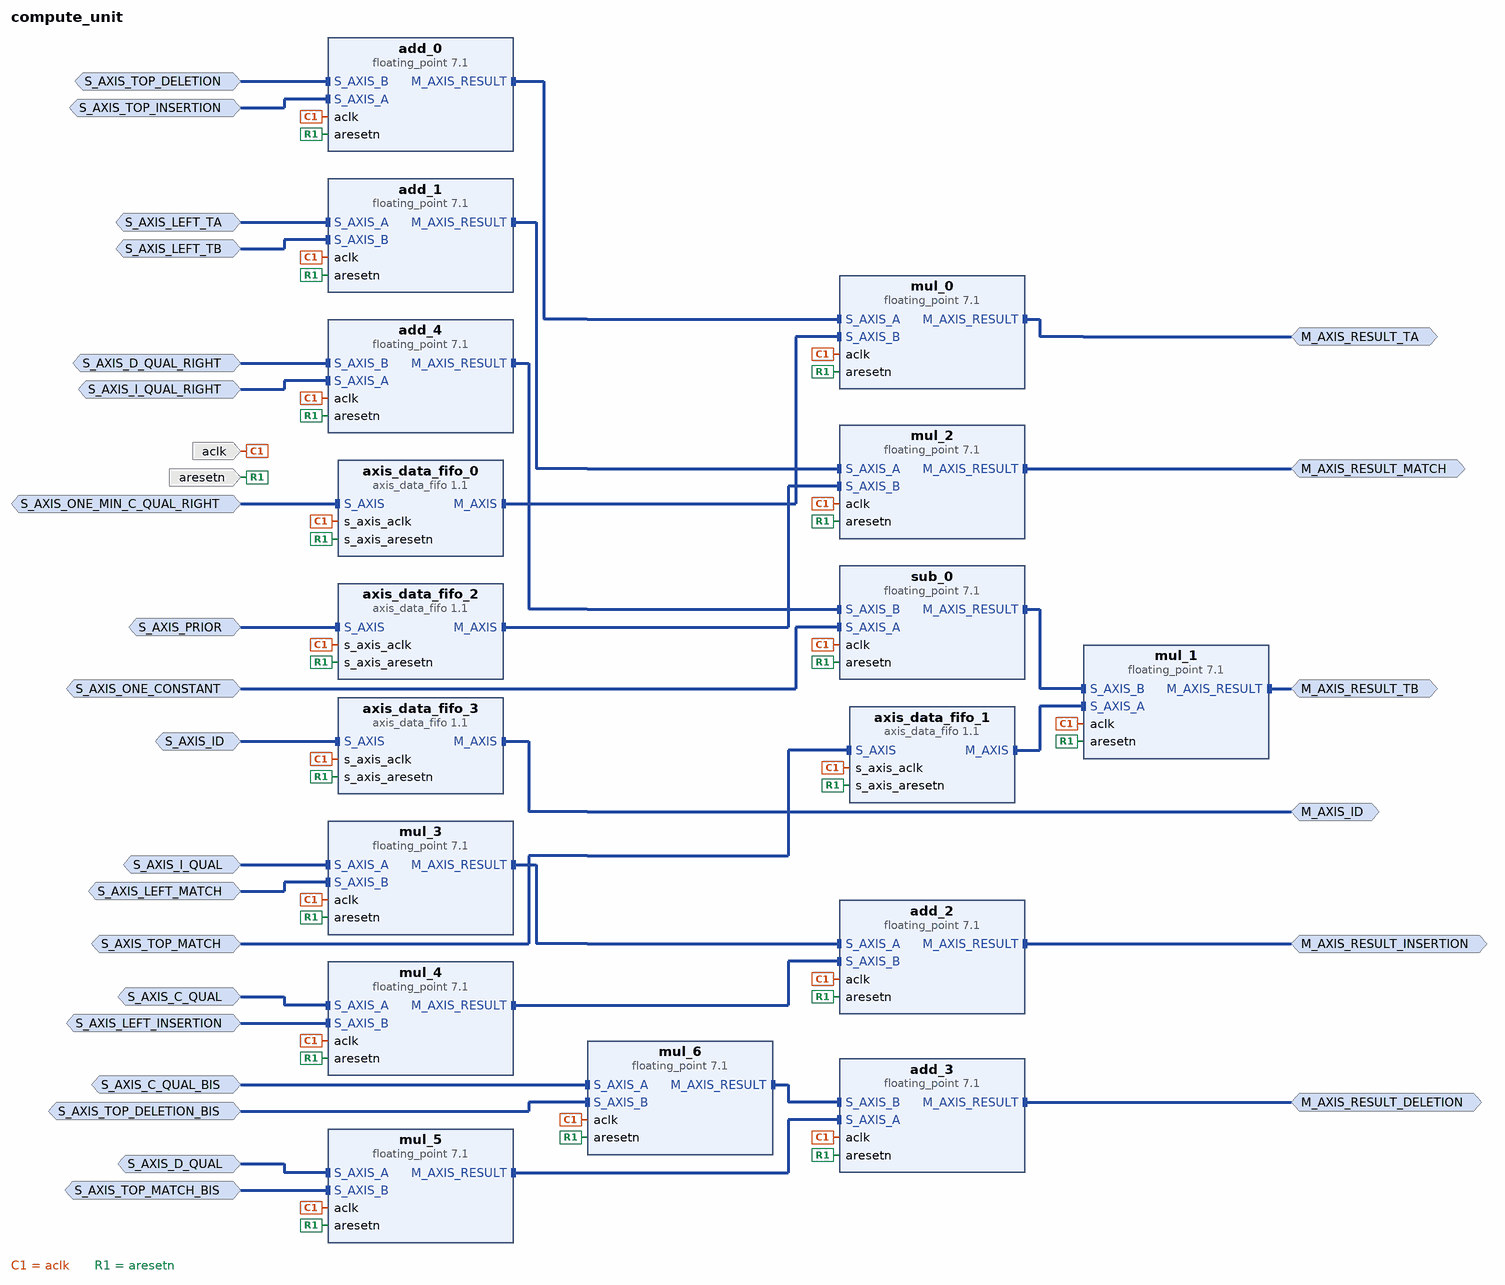
[diagram p0: block diagram of the top level]
# Vivado block design compute_unit, xcvu9p-flgb2104-2-i, Vivado 2017.4
create_bd_design compute_unit

create_bd_intf_port -mode Master -vlnv xilinx.com:interface:axis_rtl:1.0 M_AXIS_ID
set_property -dict {CONFIG.FREQ_HZ 10000000} [get_bd_intf_ports M_AXIS_ID]
create_bd_intf_port -mode Master -vlnv xilinx.com:interface:axis_rtl:1.0 M_AXIS_RESULT_DELETION
set_property -dict {CONFIG.FREQ_HZ 10000000} [get_bd_intf_ports M_AXIS_RESULT_DELETION]
create_bd_intf_port -mode Master -vlnv xilinx.com:interface:axis_rtl:1.0 M_AXIS_RESULT_INSERTION
set_property -dict {CONFIG.FREQ_HZ 10000000} [get_bd_intf_ports M_AXIS_RESULT_INSERTION]
create_bd_intf_port -mode Master -vlnv xilinx.com:interface:axis_rtl:1.0 M_AXIS_RESULT_MATCH
set_property -dict {CONFIG.FREQ_HZ 10000000} [get_bd_intf_ports M_AXIS_RESULT_MATCH]
create_bd_intf_port -mode Master -vlnv xilinx.com:interface:axis_rtl:1.0 M_AXIS_RESULT_TA
set_property -dict {CONFIG.FREQ_HZ 10000000} [get_bd_intf_ports M_AXIS_RESULT_TA]
create_bd_intf_port -mode Master -vlnv xilinx.com:interface:axis_rtl:1.0 M_AXIS_RESULT_TB
set_property -dict {CONFIG.FREQ_HZ 10000000} [get_bd_intf_ports M_AXIS_RESULT_TB]
create_bd_intf_port -mode Slave -vlnv xilinx.com:interface:axis_rtl:1.0 S_AXIS_C_QUAL
set_property -dict [list \
  CONFIG.TDATA_NUM_BYTES 4 \
  CONFIG.TDEST_WIDTH 0 \
  CONFIG.TID_WIDTH 0 \
  CONFIG.TUSER_WIDTH 0 \
  CONFIG.HAS_TREADY 1 \
  CONFIG.HAS_TSTRB 0 \
  CONFIG.HAS_TKEEP 0 \
  CONFIG.HAS_TLAST 0 \
  CONFIG.FREQ_HZ 10000000 \
  CONFIG.LAYERED_METADATA undef \
] [get_bd_intf_ports S_AXIS_C_QUAL]
create_bd_intf_port -mode Slave -vlnv xilinx.com:interface:axis_rtl:1.0 S_AXIS_C_QUAL_BIS
set_property -dict [list \
  CONFIG.TDATA_NUM_BYTES 4 \
  CONFIG.TDEST_WIDTH 0 \
  CONFIG.TID_WIDTH 0 \
  CONFIG.TUSER_WIDTH 0 \
  CONFIG.HAS_TREADY 1 \
  CONFIG.HAS_TSTRB 0 \
  CONFIG.HAS_TKEEP 0 \
  CONFIG.HAS_TLAST 0 \
  CONFIG.FREQ_HZ 10000000 \
  CONFIG.LAYERED_METADATA undef \
] [get_bd_intf_ports S_AXIS_C_QUAL_BIS]
create_bd_intf_port -mode Slave -vlnv xilinx.com:interface:axis_rtl:1.0 S_AXIS_D_QUAL
set_property -dict [list \
  CONFIG.TDATA_NUM_BYTES 4 \
  CONFIG.TDEST_WIDTH 0 \
  CONFIG.TID_WIDTH 0 \
  CONFIG.TUSER_WIDTH 0 \
  CONFIG.HAS_TREADY 1 \
  CONFIG.HAS_TSTRB 0 \
  CONFIG.HAS_TKEEP 0 \
  CONFIG.HAS_TLAST 0 \
  CONFIG.FREQ_HZ 10000000 \
  CONFIG.LAYERED_METADATA undef \
] [get_bd_intf_ports S_AXIS_D_QUAL]
create_bd_intf_port -mode Slave -vlnv xilinx.com:interface:axis_rtl:1.0 S_AXIS_D_QUAL_RIGHT
set_property -dict [list \
  CONFIG.TDATA_NUM_BYTES 4 \
  CONFIG.TDEST_WIDTH 0 \
  CONFIG.TID_WIDTH 0 \
  CONFIG.TUSER_WIDTH 0 \
  CONFIG.HAS_TREADY 1 \
  CONFIG.HAS_TSTRB 0 \
  CONFIG.HAS_TKEEP 0 \
  CONFIG.HAS_TLAST 0 \
  CONFIG.FREQ_HZ 10000000 \
  CONFIG.LAYERED_METADATA undef \
] [get_bd_intf_ports S_AXIS_D_QUAL_RIGHT]
create_bd_intf_port -mode Slave -vlnv xilinx.com:interface:axis_rtl:1.0 S_AXIS_ID
set_property -dict [list \
  CONFIG.TDATA_NUM_BYTES 4 \
  CONFIG.TDEST_WIDTH 0 \
  CONFIG.TID_WIDTH 0 \
  CONFIG.TUSER_WIDTH 0 \
  CONFIG.HAS_TREADY 1 \
  CONFIG.HAS_TSTRB 0 \
  CONFIG.HAS_TKEEP 0 \
  CONFIG.HAS_TLAST 0 \
  CONFIG.FREQ_HZ 10000000 \
  CONFIG.LAYERED_METADATA undef \
] [get_bd_intf_ports S_AXIS_ID]
create_bd_intf_port -mode Slave -vlnv xilinx.com:interface:axis_rtl:1.0 S_AXIS_I_QUAL
set_property -dict [list \
  CONFIG.TDATA_NUM_BYTES 4 \
  CONFIG.TDEST_WIDTH 0 \
  CONFIG.TID_WIDTH 0 \
  CONFIG.TUSER_WIDTH 0 \
  CONFIG.HAS_TREADY 1 \
  CONFIG.HAS_TSTRB 0 \
  CONFIG.HAS_TKEEP 0 \
  CONFIG.HAS_TLAST 0 \
  CONFIG.FREQ_HZ 10000000 \
  CONFIG.LAYERED_METADATA undef \
] [get_bd_intf_ports S_AXIS_I_QUAL]
create_bd_intf_port -mode Slave -vlnv xilinx.com:interface:axis_rtl:1.0 S_AXIS_I_QUAL_RIGHT
set_property -dict [list \
  CONFIG.TDATA_NUM_BYTES 4 \
  CONFIG.TDEST_WIDTH 0 \
  CONFIG.TID_WIDTH 0 \
  CONFIG.TUSER_WIDTH 0 \
  CONFIG.HAS_TREADY 1 \
  CONFIG.HAS_TSTRB 0 \
  CONFIG.HAS_TKEEP 0 \
  CONFIG.HAS_TLAST 0 \
  CONFIG.FREQ_HZ 10000000 \
  CONFIG.LAYERED_METADATA undef \
] [get_bd_intf_ports S_AXIS_I_QUAL_RIGHT]
create_bd_intf_port -mode Slave -vlnv xilinx.com:interface:axis_rtl:1.0 S_AXIS_LEFT_INSERTION
set_property -dict [list \
  CONFIG.TDATA_NUM_BYTES 4 \
  CONFIG.TDEST_WIDTH 0 \
  CONFIG.TID_WIDTH 0 \
  CONFIG.TUSER_WIDTH 0 \
  CONFIG.HAS_TREADY 1 \
  CONFIG.HAS_TSTRB 0 \
  CONFIG.HAS_TKEEP 0 \
  CONFIG.HAS_TLAST 0 \
  CONFIG.FREQ_HZ 10000000 \
  CONFIG.LAYERED_METADATA undef \
] [get_bd_intf_ports S_AXIS_LEFT_INSERTION]
create_bd_intf_port -mode Slave -vlnv xilinx.com:interface:axis_rtl:1.0 S_AXIS_LEFT_MATCH
set_property -dict [list \
  CONFIG.TDATA_NUM_BYTES 4 \
  CONFIG.TDEST_WIDTH 0 \
  CONFIG.TID_WIDTH 0 \
  CONFIG.TUSER_WIDTH 0 \
  CONFIG.HAS_TREADY 1 \
  CONFIG.HAS_TSTRB 0 \
  CONFIG.HAS_TKEEP 0 \
  CONFIG.HAS_TLAST 0 \
  CONFIG.FREQ_HZ 10000000 \
  CONFIG.LAYERED_METADATA undef \
] [get_bd_intf_ports S_AXIS_LEFT_MATCH]
create_bd_intf_port -mode Slave -vlnv xilinx.com:interface:axis_rtl:1.0 S_AXIS_LEFT_TA
set_property -dict [list \
  CONFIG.TDATA_NUM_BYTES 4 \
  CONFIG.TDEST_WIDTH 0 \
  CONFIG.TID_WIDTH 0 \
  CONFIG.TUSER_WIDTH 0 \
  CONFIG.HAS_TREADY 1 \
  CONFIG.HAS_TSTRB 0 \
  CONFIG.HAS_TKEEP 0 \
  CONFIG.HAS_TLAST 0 \
  CONFIG.FREQ_HZ 10000000 \
  CONFIG.LAYERED_METADATA undef \
] [get_bd_intf_ports S_AXIS_LEFT_TA]
create_bd_intf_port -mode Slave -vlnv xilinx.com:interface:axis_rtl:1.0 S_AXIS_LEFT_TB
set_property -dict [list \
  CONFIG.TDATA_NUM_BYTES 4 \
  CONFIG.TDEST_WIDTH 0 \
  CONFIG.TID_WIDTH 0 \
  CONFIG.TUSER_WIDTH 0 \
  CONFIG.HAS_TREADY 1 \
  CONFIG.HAS_TSTRB 0 \
  CONFIG.HAS_TKEEP 0 \
  CONFIG.HAS_TLAST 0 \
  CONFIG.FREQ_HZ 10000000 \
  CONFIG.LAYERED_METADATA undef \
] [get_bd_intf_ports S_AXIS_LEFT_TB]
create_bd_intf_port -mode Slave -vlnv xilinx.com:interface:axis_rtl:1.0 S_AXIS_ONE_CONSTANT
set_property -dict [list \
  CONFIG.TDATA_NUM_BYTES 4 \
  CONFIG.TDEST_WIDTH 0 \
  CONFIG.TID_WIDTH 0 \
  CONFIG.TUSER_WIDTH 0 \
  CONFIG.HAS_TREADY 1 \
  CONFIG.HAS_TSTRB 0 \
  CONFIG.HAS_TKEEP 0 \
  CONFIG.HAS_TLAST 0 \
  CONFIG.FREQ_HZ 10000000 \
  CONFIG.LAYERED_METADATA undef \
] [get_bd_intf_ports S_AXIS_ONE_CONSTANT]
create_bd_intf_port -mode Slave -vlnv xilinx.com:interface:axis_rtl:1.0 S_AXIS_ONE_MIN_C_QUAL_RIGHT
set_property -dict [list \
  CONFIG.TDATA_NUM_BYTES 4 \
  CONFIG.TDEST_WIDTH 0 \
  CONFIG.TID_WIDTH 0 \
  CONFIG.TUSER_WIDTH 0 \
  CONFIG.HAS_TREADY 1 \
  CONFIG.HAS_TSTRB 0 \
  CONFIG.HAS_TKEEP 0 \
  CONFIG.HAS_TLAST 0 \
  CONFIG.FREQ_HZ 10000000 \
  CONFIG.LAYERED_METADATA undef \
] [get_bd_intf_ports S_AXIS_ONE_MIN_C_QUAL_RIGHT]
create_bd_intf_port -mode Slave -vlnv xilinx.com:interface:axis_rtl:1.0 S_AXIS_PRIOR
set_property -dict [list \
  CONFIG.TDATA_NUM_BYTES 4 \
  CONFIG.TDEST_WIDTH 0 \
  CONFIG.TID_WIDTH 0 \
  CONFIG.TUSER_WIDTH 0 \
  CONFIG.HAS_TREADY 1 \
  CONFIG.HAS_TSTRB 0 \
  CONFIG.HAS_TKEEP 0 \
  CONFIG.HAS_TLAST 0 \
  CONFIG.FREQ_HZ 10000000 \
  CONFIG.LAYERED_METADATA undef \
] [get_bd_intf_ports S_AXIS_PRIOR]
create_bd_intf_port -mode Slave -vlnv xilinx.com:interface:axis_rtl:1.0 S_AXIS_TOP_DELETION
set_property -dict [list \
  CONFIG.TDATA_NUM_BYTES 4 \
  CONFIG.TDEST_WIDTH 0 \
  CONFIG.TID_WIDTH 0 \
  CONFIG.TUSER_WIDTH 0 \
  CONFIG.HAS_TREADY 1 \
  CONFIG.HAS_TSTRB 0 \
  CONFIG.HAS_TKEEP 0 \
  CONFIG.HAS_TLAST 0 \
  CONFIG.FREQ_HZ 10000000 \
  CONFIG.LAYERED_METADATA undef \
] [get_bd_intf_ports S_AXIS_TOP_DELETION]
create_bd_intf_port -mode Slave -vlnv xilinx.com:interface:axis_rtl:1.0 S_AXIS_TOP_DELETION_BIS
set_property -dict [list \
  CONFIG.TDATA_NUM_BYTES 4 \
  CONFIG.TDEST_WIDTH 0 \
  CONFIG.TID_WIDTH 0 \
  CONFIG.TUSER_WIDTH 0 \
  CONFIG.HAS_TREADY 1 \
  CONFIG.HAS_TSTRB 0 \
  CONFIG.HAS_TKEEP 0 \
  CONFIG.HAS_TLAST 0 \
  CONFIG.FREQ_HZ 10000000 \
  CONFIG.LAYERED_METADATA undef \
] [get_bd_intf_ports S_AXIS_TOP_DELETION_BIS]
create_bd_intf_port -mode Slave -vlnv xilinx.com:interface:axis_rtl:1.0 S_AXIS_TOP_INSERTION
set_property -dict [list \
  CONFIG.TDATA_NUM_BYTES 4 \
  CONFIG.TDEST_WIDTH 0 \
  CONFIG.TID_WIDTH 0 \
  CONFIG.TUSER_WIDTH 0 \
  CONFIG.HAS_TREADY 1 \
  CONFIG.HAS_TSTRB 0 \
  CONFIG.HAS_TKEEP 0 \
  CONFIG.HAS_TLAST 0 \
  CONFIG.FREQ_HZ 10000000 \
  CONFIG.LAYERED_METADATA undef \
] [get_bd_intf_ports S_AXIS_TOP_INSERTION]
create_bd_intf_port -mode Slave -vlnv xilinx.com:interface:axis_rtl:1.0 S_AXIS_TOP_MATCH
set_property -dict [list \
  CONFIG.TDATA_NUM_BYTES 4 \
  CONFIG.TDEST_WIDTH 0 \
  CONFIG.TID_WIDTH 0 \
  CONFIG.TUSER_WIDTH 0 \
  CONFIG.HAS_TREADY 1 \
  CONFIG.HAS_TSTRB 0 \
  CONFIG.HAS_TKEEP 0 \
  CONFIG.HAS_TLAST 0 \
  CONFIG.FREQ_HZ 10000000 \
  CONFIG.LAYERED_METADATA undef \
] [get_bd_intf_ports S_AXIS_TOP_MATCH]
create_bd_intf_port -mode Slave -vlnv xilinx.com:interface:axis_rtl:1.0 S_AXIS_TOP_MATCH_BIS
set_property -dict [list \
  CONFIG.TDATA_NUM_BYTES 4 \
  CONFIG.TDEST_WIDTH 0 \
  CONFIG.TID_WIDTH 0 \
  CONFIG.TUSER_WIDTH 0 \
  CONFIG.HAS_TREADY 1 \
  CONFIG.HAS_TSTRB 0 \
  CONFIG.HAS_TKEEP 0 \
  CONFIG.HAS_TLAST 0 \
  CONFIG.FREQ_HZ 10000000 \
  CONFIG.LAYERED_METADATA undef \
] [get_bd_intf_ports S_AXIS_TOP_MATCH_BIS]
create_bd_port -dir I -type clk aclk
set_property -dict [list \
  CONFIG.FREQ_HZ 10000000 \
  CONFIG.ASSOCIATED_BUSIF S_AXIS_fI_j:S_AXIS_fD_j:S_AXIS_a_dm:S_AXIS_a_mm:S_AXIS_fM_j:S_AXIS_ta_i:S_AXIS_tb_i:S_AXIS_prior:S_AXIS_a_mi:S_AXIS_fM_i:S_AXIS_a_ii:S_AXIS_fI_i:S_AXIS_a_md:S_AXIS_fM_j_copy:S_AXIS_a_dd:S_AXIS_fD_j_copy:M_AXIS_RESULT_TBA:M_AXIS_RESULT_TB:M_AXIS_RESULT_MATCH:M_AXIS_RESULT_INSERTION:M_AXIS_RESULT_DELETION:M_AXIS_RESULT_TA:S_AXIS_TOP_INSERTION:S_AXIS_TOP_DELETION:S_AXIS_ONE_MIN_C_QUAL_RIGHT:S_AXIS_TOP_MATCH:S_AXIS_ONE_MIN_I_QUAL_RIGHT:S_AXIS_D_QUAL_RIGHT:S_AXIS_LEFT_TA:S_AXIS_LEFT_TB:S_AXIS_I_QUAL:S_AXIS_LEFT_MATCH:S_AXIS_C_QUAL:S_AXIS_LEFT_INSERTION:S_AXIS_D_QUAL:S_AXIS_TOP_MATCH_BIS:S_AXIS_C_QUAL_BIS:S_AXIS_TOP_DELETION_BIS:M_AXIS_ID:S_AXIS_ID:S_AXIS_ONE_CONSTANT:S_AXIS_I_QUAL_RIGHT \
] [get_bd_ports aclk]
create_bd_port -dir I -type rst aresetn

create_bd_cell -type ip -vlnv xilinx.com:ip:floating_point:7.1 add_0
set_property -dict [list \
  CONFIG.Add_Sub_Value Add \
  CONFIG.Flow_Control Blocking \
  CONFIG.Has_RESULT_TREADY true \
  CONFIG.C_Latency 12 \
  CONFIG.Has_ARESETn true \
] [get_bd_cells add_0]
create_bd_cell -type ip -vlnv xilinx.com:ip:floating_point:7.1 add_1
set_property -dict [list \
  CONFIG.Add_Sub_Value Add \
  CONFIG.Flow_Control Blocking \
  CONFIG.Has_RESULT_TREADY true \
  CONFIG.C_Latency 12 \
  CONFIG.Has_ARESETn true \
] [get_bd_cells add_1]
create_bd_cell -type ip -vlnv xilinx.com:ip:floating_point:7.1 add_2
set_property -dict [list \
  CONFIG.Add_Sub_Value Add \
  CONFIG.Flow_Control Blocking \
  CONFIG.Has_RESULT_TREADY true \
  CONFIG.C_Latency 12 \
  CONFIG.Has_ARESETn true \
] [get_bd_cells add_2]
create_bd_cell -type ip -vlnv xilinx.com:ip:floating_point:7.1 add_3
set_property -dict [list \
  CONFIG.Add_Sub_Value Add \
  CONFIG.Flow_Control Blocking \
  CONFIG.Has_RESULT_TREADY true \
  CONFIG.C_Latency 12 \
  CONFIG.Has_ARESETn true \
] [get_bd_cells add_3]
create_bd_cell -type ip -vlnv xilinx.com:ip:floating_point:7.1 add_4
set_property -dict [list \
  CONFIG.Operation_Type Add_Subtract \
  CONFIG.Add_Sub_Value Add \
  CONFIG.Result_Precision_Type Single \
  CONFIG.C_Result_Exponent_Width 8 \
  CONFIG.C_Result_Fraction_Width 24 \
  CONFIG.C_Mult_Usage Full_Usage \
  CONFIG.Maximum_Latency false \
  CONFIG.C_Latency 6 \
  CONFIG.C_Rate 1 \
  CONFIG.Has_ARESETn true \
  CONFIG.Has_A_TLAST false \
  CONFIG.RESULT_TLAST_Behv Null \
] [get_bd_cells add_4]
create_bd_cell -type ip -vlnv xilinx.com:ip:axis_data_fifo:1.1 axis_data_fifo_0
set_property -dict {CONFIG.TDATA_NUM_BYTES 4 CONFIG.FIFO_DEPTH 16} [get_bd_cells axis_data_fifo_0]
create_bd_cell -type ip -vlnv xilinx.com:ip:axis_data_fifo:1.1 axis_data_fifo_1
set_property -dict {CONFIG.TDATA_NUM_BYTES 4 CONFIG.FIFO_DEPTH 16} [get_bd_cells axis_data_fifo_1]
create_bd_cell -type ip -vlnv xilinx.com:ip:axis_data_fifo:1.1 axis_data_fifo_2
set_property -dict {CONFIG.TDATA_NUM_BYTES 4 CONFIG.FIFO_DEPTH 16} [get_bd_cells axis_data_fifo_2]
create_bd_cell -type ip -vlnv xilinx.com:ip:axis_data_fifo:1.1 axis_data_fifo_3
set_property -dict {CONFIG.TDATA_NUM_BYTES 4 CONFIG.FIFO_DEPTH 32} [get_bd_cells axis_data_fifo_3]
create_bd_cell -type ip -vlnv xilinx.com:ip:floating_point:7.1 mul_0
set_property -dict [list \
  CONFIG.Operation_Type Multiply \
  CONFIG.Result_Precision_Type Single \
  CONFIG.C_Result_Exponent_Width 8 \
  CONFIG.C_Result_Fraction_Width 24 \
  CONFIG.C_Mult_Usage Full_Usage \
  CONFIG.Flow_Control Blocking \
  CONFIG.Has_RESULT_TREADY true \
  CONFIG.C_Latency 9 \
  CONFIG.C_Rate 1 \
  CONFIG.Has_ARESETn true \
] [get_bd_cells mul_0]
create_bd_cell -type ip -vlnv xilinx.com:ip:floating_point:7.1 mul_1
set_property -dict [list \
  CONFIG.Operation_Type Multiply \
  CONFIG.Result_Precision_Type Single \
  CONFIG.C_Result_Exponent_Width 8 \
  CONFIG.C_Result_Fraction_Width 24 \
  CONFIG.C_Mult_Usage Full_Usage \
  CONFIG.Flow_Control Blocking \
  CONFIG.Has_RESULT_TREADY true \
  CONFIG.C_Latency 9 \
  CONFIG.C_Rate 1 \
  CONFIG.Has_ARESETn true \
] [get_bd_cells mul_1]
create_bd_cell -type ip -vlnv xilinx.com:ip:floating_point:7.1 mul_2
set_property -dict [list \
  CONFIG.Operation_Type Multiply \
  CONFIG.Result_Precision_Type Single \
  CONFIG.C_Result_Exponent_Width 8 \
  CONFIG.C_Result_Fraction_Width 24 \
  CONFIG.C_Mult_Usage Full_Usage \
  CONFIG.Flow_Control Blocking \
  CONFIG.Has_RESULT_TREADY true \
  CONFIG.C_Latency 9 \
  CONFIG.C_Rate 1 \
  CONFIG.Has_ARESETn true \
] [get_bd_cells mul_2]
create_bd_cell -type ip -vlnv xilinx.com:ip:floating_point:7.1 mul_3
set_property -dict [list \
  CONFIG.Operation_Type Multiply \
  CONFIG.Result_Precision_Type Single \
  CONFIG.C_Result_Exponent_Width 8 \
  CONFIG.C_Result_Fraction_Width 24 \
  CONFIG.C_Mult_Usage Full_Usage \
  CONFIG.Flow_Control Blocking \
  CONFIG.Has_RESULT_TREADY true \
  CONFIG.C_Latency 9 \
  CONFIG.C_Rate 1 \
  CONFIG.Has_ARESETn true \
] [get_bd_cells mul_3]
create_bd_cell -type ip -vlnv xilinx.com:ip:floating_point:7.1 mul_4
set_property -dict [list \
  CONFIG.Operation_Type Multiply \
  CONFIG.Result_Precision_Type Single \
  CONFIG.C_Result_Exponent_Width 8 \
  CONFIG.C_Result_Fraction_Width 24 \
  CONFIG.C_Mult_Usage Full_Usage \
  CONFIG.Flow_Control Blocking \
  CONFIG.Has_RESULT_TREADY true \
  CONFIG.C_Latency 9 \
  CONFIG.C_Rate 1 \
  CONFIG.Has_ARESETn true \
] [get_bd_cells mul_4]
create_bd_cell -type ip -vlnv xilinx.com:ip:floating_point:7.1 mul_5
set_property -dict [list \
  CONFIG.Operation_Type Multiply \
  CONFIG.Result_Precision_Type Single \
  CONFIG.C_Result_Exponent_Width 8 \
  CONFIG.C_Result_Fraction_Width 24 \
  CONFIG.C_Mult_Usage Full_Usage \
  CONFIG.Flow_Control Blocking \
  CONFIG.Has_RESULT_TREADY true \
  CONFIG.C_Latency 9 \
  CONFIG.C_Rate 1 \
  CONFIG.Has_ARESETn true \
] [get_bd_cells mul_5]
create_bd_cell -type ip -vlnv xilinx.com:ip:floating_point:7.1 mul_6
set_property -dict [list \
  CONFIG.Operation_Type Multiply \
  CONFIG.Result_Precision_Type Single \
  CONFIG.C_Result_Exponent_Width 8 \
  CONFIG.C_Result_Fraction_Width 24 \
  CONFIG.C_Mult_Usage Full_Usage \
  CONFIG.Flow_Control Blocking \
  CONFIG.Has_RESULT_TREADY true \
  CONFIG.C_Latency 9 \
  CONFIG.C_Rate 1 \
  CONFIG.Has_ARESETn true \
] [get_bd_cells mul_6]
create_bd_cell -type ip -vlnv xilinx.com:ip:floating_point:7.1 sub_0
set_property -dict [list \
  CONFIG.Add_Sub_Value Subtract \
  CONFIG.Maximum_Latency false \
  CONFIG.C_Latency 6 \
  CONFIG.Has_ACLKEN false \
  CONFIG.Has_ARESETn true \
] [get_bd_cells sub_0]

# ---- connections ----

connect_bd_intf_net [get_bd_intf_pins add_0/M_AXIS_RESULT] [get_bd_intf_pins mul_0/S_AXIS_A]
connect_bd_intf_net [get_bd_intf_pins add_1/M_AXIS_RESULT] [get_bd_intf_pins mul_2/S_AXIS_A]
connect_bd_intf_net [get_bd_intf_pins add_4/M_AXIS_RESULT] [get_bd_intf_pins sub_0/S_AXIS_B]
connect_bd_intf_net [get_bd_intf_pins axis_data_fifo_0/M_AXIS] [get_bd_intf_pins mul_0/S_AXIS_B]
connect_bd_intf_net [get_bd_intf_pins axis_data_fifo_1/M_AXIS] [get_bd_intf_pins mul_1/S_AXIS_A]
connect_bd_intf_net -intf_net axis_data_fifo_3_M_AXIS [get_bd_intf_pins axis_data_fifo_2/M_AXIS] [get_bd_intf_pins mul_2/S_AXIS_B]
connect_bd_intf_net -intf_net floating_point_0_M_AXIS_RESULT [get_bd_intf_pins mul_1/S_AXIS_B] [get_bd_intf_pins sub_0/M_AXIS_RESULT]
connect_bd_intf_net [get_bd_intf_pins add_2/S_AXIS_A] [get_bd_intf_pins mul_3/M_AXIS_RESULT]
connect_bd_intf_net [get_bd_intf_pins add_2/S_AXIS_B] [get_bd_intf_pins mul_4/M_AXIS_RESULT]
connect_bd_intf_net [get_bd_intf_pins add_3/S_AXIS_A] [get_bd_intf_pins mul_5/M_AXIS_RESULT]
connect_bd_intf_net [get_bd_intf_pins add_3/S_AXIS_B] [get_bd_intf_pins mul_6/M_AXIS_RESULT]
connect_bd_intf_net [get_bd_intf_ports M_AXIS_ID] [get_bd_intf_pins axis_data_fifo_3/M_AXIS]
connect_bd_intf_net [get_bd_intf_ports M_AXIS_RESULT_DELETION] [get_bd_intf_pins add_3/M_AXIS_RESULT]
connect_bd_intf_net [get_bd_intf_ports M_AXIS_RESULT_INSERTION] [get_bd_intf_pins add_2/M_AXIS_RESULT]
connect_bd_intf_net [get_bd_intf_ports M_AXIS_RESULT_MATCH] [get_bd_intf_pins mul_2/M_AXIS_RESULT]
connect_bd_intf_net [get_bd_intf_ports M_AXIS_RESULT_TA] [get_bd_intf_pins mul_0/M_AXIS_RESULT]
connect_bd_intf_net [get_bd_intf_ports M_AXIS_RESULT_TB] [get_bd_intf_pins mul_1/M_AXIS_RESULT]
connect_bd_intf_net -intf_net S_AXIS_A_0_5 [get_bd_intf_ports S_AXIS_C_QUAL] [get_bd_intf_pins mul_4/S_AXIS_A]
connect_bd_intf_net -intf_net S_AXIS_A_0_7 [get_bd_intf_ports S_AXIS_C_QUAL_BIS] [get_bd_intf_pins mul_6/S_AXIS_A]
connect_bd_intf_net -intf_net S_AXIS_A_0_6 [get_bd_intf_ports S_AXIS_D_QUAL] [get_bd_intf_pins mul_5/S_AXIS_A]
connect_bd_intf_net [get_bd_intf_ports S_AXIS_D_QUAL_RIGHT] [get_bd_intf_pins add_4/S_AXIS_B]
connect_bd_intf_net -intf_net S_AXIS_0_4 [get_bd_intf_ports S_AXIS_ID] [get_bd_intf_pins axis_data_fifo_3/S_AXIS]
connect_bd_intf_net -intf_net S_AXIS_A_0_4 [get_bd_intf_ports S_AXIS_I_QUAL] [get_bd_intf_pins mul_3/S_AXIS_A]
connect_bd_intf_net -intf_net S_AXIS_A_0_8 [get_bd_intf_ports S_AXIS_I_QUAL_RIGHT] [get_bd_intf_pins add_4/S_AXIS_A]
connect_bd_intf_net -intf_net S_AXIS_B_0_5 [get_bd_intf_ports S_AXIS_LEFT_INSERTION] [get_bd_intf_pins mul_4/S_AXIS_B]
connect_bd_intf_net -intf_net S_AXIS_B_0_4 [get_bd_intf_ports S_AXIS_LEFT_MATCH] [get_bd_intf_pins mul_3/S_AXIS_B]
connect_bd_intf_net -intf_net S_AXIS_A_0_3 [get_bd_intf_ports S_AXIS_LEFT_TA] [get_bd_intf_pins add_1/S_AXIS_A]
connect_bd_intf_net -intf_net S_AXIS_B_0_3 [get_bd_intf_ports S_AXIS_LEFT_TB] [get_bd_intf_pins add_1/S_AXIS_B]
connect_bd_intf_net [get_bd_intf_ports S_AXIS_ONE_CONSTANT] [get_bd_intf_pins sub_0/S_AXIS_A]
connect_bd_intf_net -intf_net S_AXIS_0_1 [get_bd_intf_ports S_AXIS_ONE_MIN_C_QUAL_RIGHT] [get_bd_intf_pins axis_data_fifo_0/S_AXIS]
connect_bd_intf_net -intf_net S_AXIS_0_3 [get_bd_intf_ports S_AXIS_PRIOR] [get_bd_intf_pins axis_data_fifo_2/S_AXIS]
connect_bd_intf_net -intf_net S_AXIS_B_0_1 [get_bd_intf_ports S_AXIS_TOP_DELETION] [get_bd_intf_pins add_0/S_AXIS_B]
connect_bd_intf_net -intf_net S_AXIS_B_0_7 [get_bd_intf_ports S_AXIS_TOP_DELETION_BIS] [get_bd_intf_pins mul_6/S_AXIS_B]
connect_bd_intf_net -intf_net S_AXIS_A_0_1 [get_bd_intf_ports S_AXIS_TOP_INSERTION] [get_bd_intf_pins add_0/S_AXIS_A]
connect_bd_intf_net -intf_net S_AXIS_0_2 [get_bd_intf_ports S_AXIS_TOP_MATCH] [get_bd_intf_pins axis_data_fifo_1/S_AXIS]
connect_bd_intf_net -intf_net S_AXIS_B_0_6 [get_bd_intf_ports S_AXIS_TOP_MATCH_BIS] [get_bd_intf_pins mul_5/S_AXIS_B]
connect_bd_net -net aclk_0_1 [get_bd_ports aclk] \
  [get_bd_pins add_0/aclk] [get_bd_pins add_1/aclk] [get_bd_pins add_2/aclk] [get_bd_pins add_3/aclk] \
  [get_bd_pins add_4/aclk] [get_bd_pins axis_data_fifo_0/s_axis_aclk] [get_bd_pins axis_data_fifo_1/s_axis_aclk] \
  [get_bd_pins axis_data_fifo_2/s_axis_aclk] [get_bd_pins axis_data_fifo_3/s_axis_aclk] [get_bd_pins mul_0/aclk] \
  [get_bd_pins mul_1/aclk] [get_bd_pins mul_2/aclk] [get_bd_pins mul_3/aclk] [get_bd_pins mul_4/aclk] \
  [get_bd_pins mul_5/aclk] [get_bd_pins mul_6/aclk] [get_bd_pins sub_0/aclk]
connect_bd_net [get_bd_ports aresetn] \
  [get_bd_pins add_0/aresetn] [get_bd_pins add_1/aresetn] [get_bd_pins add_2/aresetn] [get_bd_pins add_3/aresetn] \
  [get_bd_pins add_4/aresetn] [get_bd_pins axis_data_fifo_0/s_axis_aresetn] [get_bd_pins axis_data_fifo_1/s_axis_aresetn] \
  [get_bd_pins axis_data_fifo_2/s_axis_aresetn] [get_bd_pins axis_data_fifo_3/s_axis_aresetn] [get_bd_pins mul_0/aresetn] \
  [get_bd_pins mul_1/aresetn] [get_bd_pins mul_2/aresetn] [get_bd_pins mul_3/aresetn] [get_bd_pins mul_4/aresetn] \
  [get_bd_pins mul_5/aresetn] [get_bd_pins mul_6/aresetn] [get_bd_pins sub_0/aresetn]

validate_bd_design
save_bd_design
